# Altium project LED_Box.PrjPcb
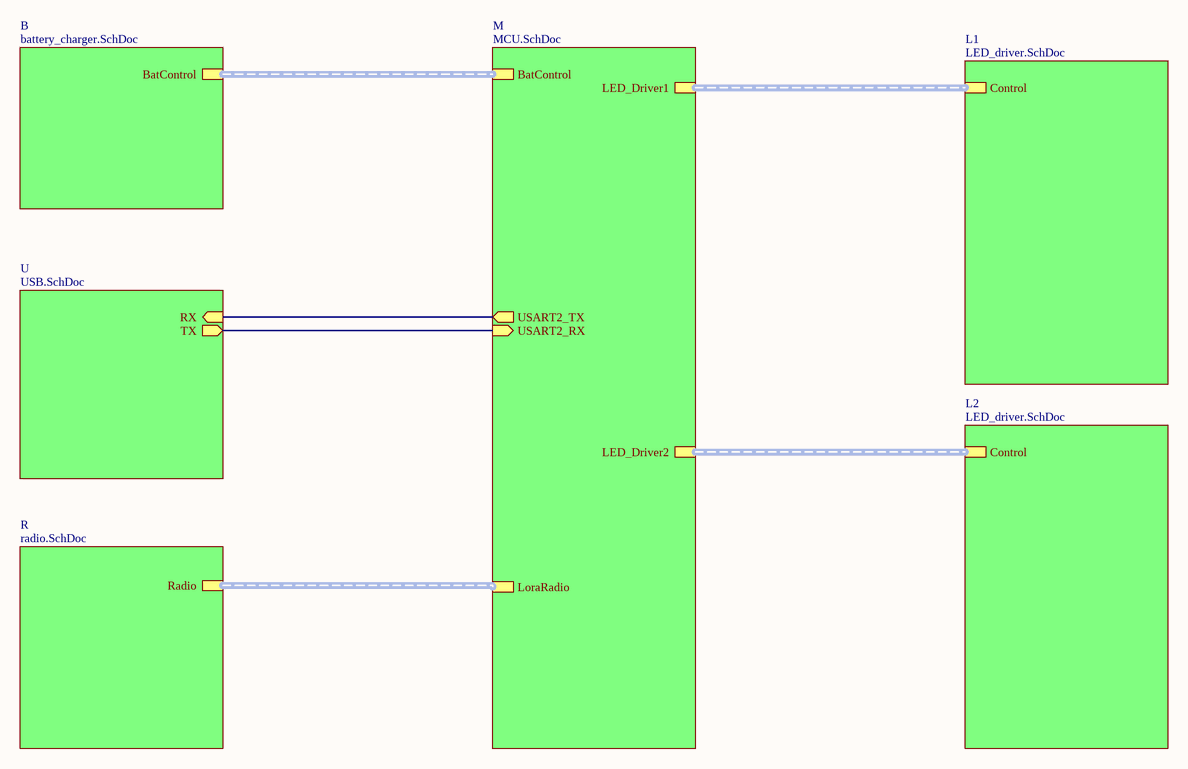
[diagram p0: main.SchDoc]
6 sheets, 189 parts. Net scope: hierarchical (ports join the sheet entries above them; power ports are global).
Board file: LED_Box.PcbDoc
Sheets:
  main.SchDoc
    B = battery_charger.SchDoc
    U = USB.SchDoc
    L1 = LED_driver.SchDoc
    L2 = LED_driver.SchDoc
    R = radio.SchDoc
    M = MCU.SchDoc

## Sheet main.SchDoc: Gesamtansicht
size A4; Author: Gerald Ebmer; DrawnBy: Gerald Ebmer; Engineer: Gerald Ebmer; Revision: 1.0; SheetNumber: 1; SheetTotal: 6; PageSetup: Record=PageOptions|CenterHorizontal=True|CenterVertical=True|PrintScale=1.00|XCorrection=1.00|YCorrection=1.00|PrintKind=0|BorderSize=5000000|LeftOffset=0|BottomOffset=0|Orientation=2|PaperLength=1000|PaperWidth=1000|Scale=100|PaperSource=7|PrintQuality=-3|MediaType=1|DitherType=10|PrintScaleMode=1|PaperKind=A4|PaperIndex=9

### Sub-sheets
B = battery_charger.SchDoc: BatControl (harness BatControl)
L1 = LED_driver.SchDoc: Control (harness LED_Driver)
L2 = LED_driver.SchDoc: Control (harness LED_Driver)
M = MCU.SchDoc: BatControl (harness BatControl), LED_Driver1 (harness LED_Driver), LED_Driver2 (harness LED_Driver), USART2_TX (out), USART2_RX (in), LoraRadio (harness Radio)
R = radio.SchDoc: Radio (harness Radio)
U = USB.SchDoc: RX (in), TX (out)

### Nets
USART2_RX: sheet U/TX, sheet M/USART2_RX
USART2_TX: sheet U/RX, sheet M/USART2_TX

### Buses and harness runs
harness sheet B/BatControl = sheet M/BatControl
harness sheet L1/Control = sheet M/LED_Driver1
harness sheet L2/Control = sheet M/LED_Driver2
harness sheet M/LoraRadio = sheet R/Radio

### Notes on the sheet
- Title
- Size:
- Date:
- A4
- Number:
- Time:
- Revision:
- Sheet
- of
- File:

## Sheet battery_charger.SchDoc: Battery & Power Management
size A4; Author: Gerald Ebmer; DrawnBy: Gerald Ebmer; Engineer: Gerald Ebmer; SheetNumber: 5; SheetTotal: 6; PageSetup: Record=PageOptions|CenterHorizontal=True|CenterVertical=True|PrintScale=1.00|XCorrection=1.00|YCorrection=1.00|PrintKind=0|BorderSize=5000000|LeftOffset=0|BottomOffset=0|Orientation=2|PaperLength=1000|PaperWidth=1000|Scale=100|PaperSource=7|PrintQuality=-3|MediaType=1|DitherType=10|PrintScaleMode=1|PaperKind=A4|PaperIndex=9
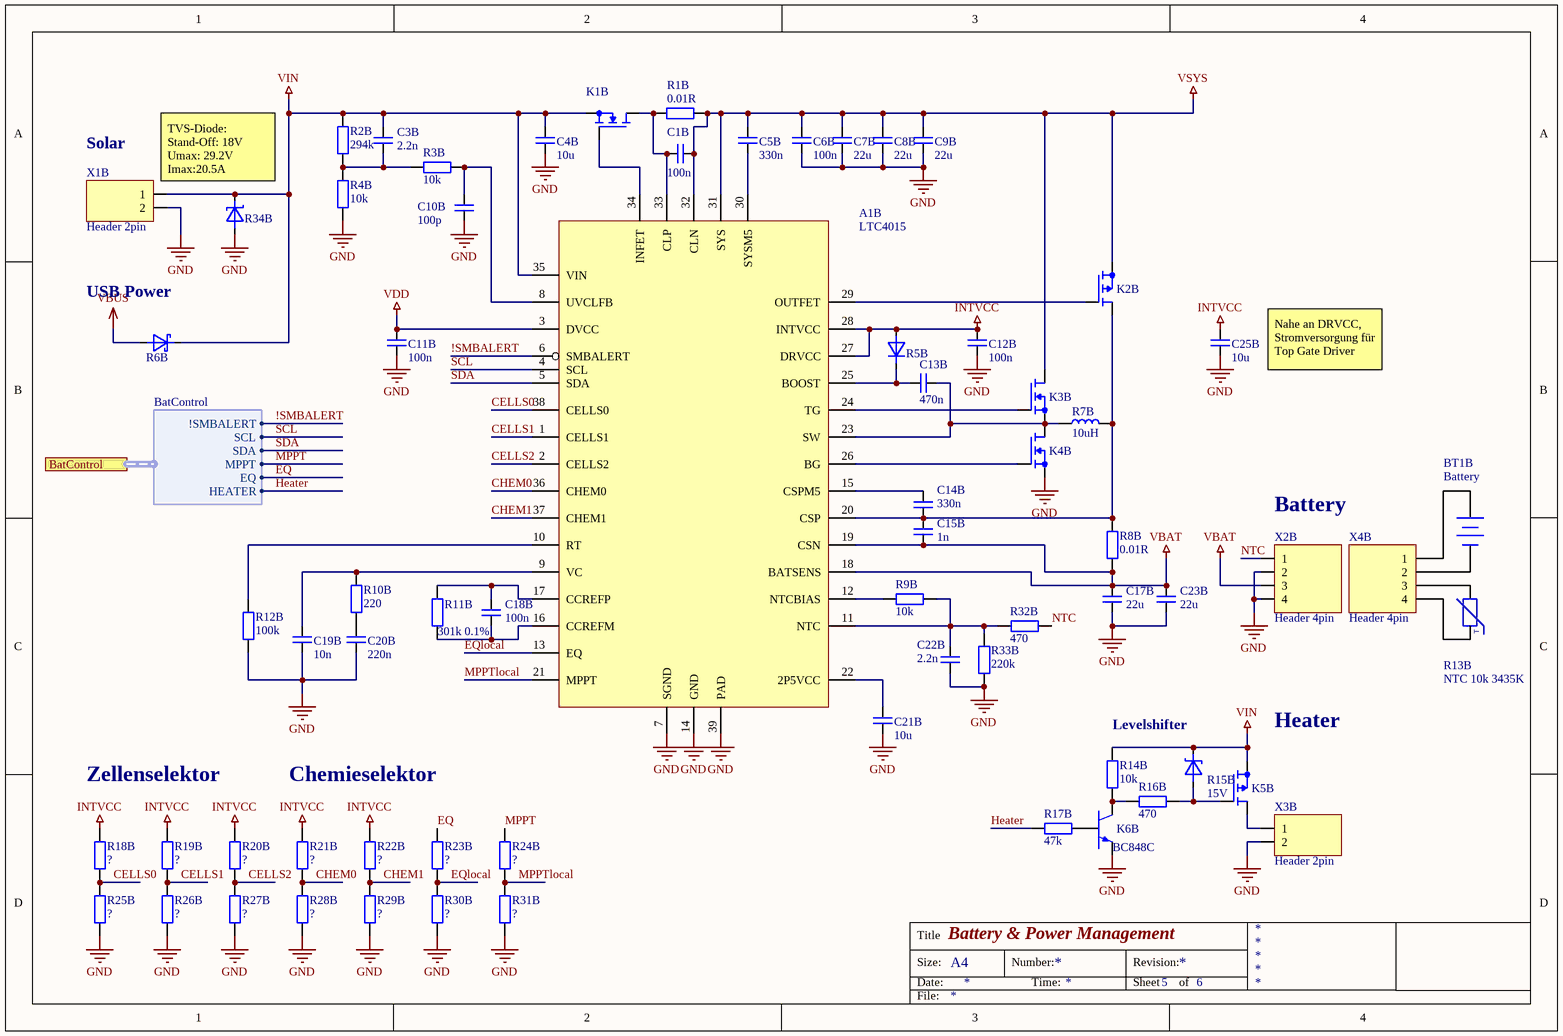
[diagram p1: battery_charger.SchDoc]

### Parts
A1B  LTC4015  [QFN38]
BT1B  Battery
C1B  100n  [0805]
C3B  2.2n  [0805]
C4B  10u  [1812]
C5B  330n  [0805]
C6B  100n  [0805]
C7B  22u  [1812]
C8B  22u  [1812]
C9B  22u  [1812]
C10B  100p  [0805]
C11B  100n  [0805]
C12B  100n  [0805]
C13B  470n  [0805]
C14B  330n  [0805]
C15B  1n  [0805]
C17B  22u  [1210]
C18B  100n  [0805]
C19B  10n  [0805]
C20B  220n  [0805]
C21B  10u  [0805]
C22B  2.2n  [0805]
C23B  22u  [1210]
C25B  10u  [0805]
K1B  FDMC8327L  [Power33]  (value not drawn)
K2B  SI7611DN  [Power33]  (value not drawn)
K3B  FDMC8327L  [Power33]  (value not drawn)
K4B  FDMC8327L  [Power33]  (value not drawn)
K5B  pmos FDC658  [SuperSOT-6]  (value not drawn)
K6B  BC848C  [SOT23-3]
R1B  0.01R  [2512]
R2B  294k  [0805]
R3B  10k  [0805]
R4B  10k  [0805]
R5B  1N4148W  [SOD123F]  (value not drawn)
R6B  Diode shottky  [PowerDI123]  (value not drawn)
R7B  10uH  [INDP_13.2_12.9X3.5M]
R8B  0.01R  [2512]
R9B  10k  [0805]
R10B  220  [0805]
R11B  301k 0.1%  [0805]
R12B  100k  [0805]
R13B  NTC 10k 3435K
R14B  10k  [0805]
R15B  15V  [SOD523]
R16B  470  [0805]
R17B  47k  [0805]
R18B  ?  [0805]
R19B  ?  [0805]
R20B  ?  [0805]
R21B  ?  [0805]
R22B  ?  [0805]
R23B  ?  [0805]
R24B  ?  [0805]
R25B  ?  [0805]
R26B  ?  [0805]
R27B  ?  [0805]
R28B  ?  [0805]
R29B  ?  [0805]
R30B  ?  [0805]
R31B  ?  [0805]
R32B  470  [0805]
R33B  220k  [0805]
R34B  TVS 29.2Vmax  [DO 214AA]  (value not drawn)
X1B  Header 2pin  [PHOENIX_1729128]
X2B  Header 4pin  [Phoenix, 5mm pitch, 4pin]
X3B  Header 2pin  [PHOENIX_1729128]
X4B  Header 4pin

### Ports
BatControl (harness BatControl)

### Harnesses
BatControl: !SMBALERT, SCL, SDA, MPPT, EQ, HEATER

### Nets
GND: A1B.7(SGND) A1B.14(GND) A1B.39(PAD) C4B.2 C6B.2 C7B.2 C8B.2 C9B.2 C10B.1 C11B.2 C12B.2 C17B.2 C19B.2 C20B.1 C21B.2 C22B.1 C23B.2 C25B.2 K4B.2(Source) K6B.2(Emitter) R4B.1 R12B.2 R25B.2 R26B.2 R27B.2 R28B.2 R29B.2 R30B.2 R31B.2 R33B.2 R34B.2(Annode) X1B.2 X2B.2 X2B.4 X3B.2
INTVCC: A1B.27(DRVCC) A1B.28(INTVCC) C12B.1 C25B.1 R5B.2(Annode) R18B.1 R19B.1 R20B.1 R21B.1 R22B.1
VBAT: A1B.18(BATSENS) A1B.19(CSN) C15B.1 C17B.1 C23B.1 R8B.2 X2B.3
VBUS: R6B.2(Annode)
VDD: A1B.3(DVCC) C11B.1
VIN: A1B.35(VIN) C3B.2 C4B.1 K1B.2(Source) K5B.2(Source) R2B.2 R6B.1(Kathode) R14B.2 R15B.1(Kathode) R34B.1(Kathode) X1B.1
VSYS: A1B.31(SYS) A1B.32(CLN) C1B.1 C5B.1 C6B.1 C7B.1 C8B.1 C9B.1 K2B.2(Source) K3B.1(Drain) R1B.1
!SMBALERT: A1B.6(SMBALERT) ; port BatControl.!SMBALERT
CELLS0: A1B.38(CELLS0) R18B.2 R25B.1
CELLS1: A1B.1(CELLS1) R19B.2 R26B.1
CELLS2: A1B.2(CELLS2) R20B.2 R27B.1
CHEM0: A1B.36(CHEM0) R21B.2 R28B.1
CHEM1: A1B.37(CHEM1) R22B.2 R29B.1
EQ: R23B.1 ; port BatControl.EQ
EQlocal: A1B.13(EQ) R23B.2 R30B.1
Heater: R17B.1 ; port BatControl.HEATER
MPPT: R24B.1 ; port BatControl.MPPT
MPPTlocal: A1B.21(MPPT) R24B.2 R31B.1
NTC: R32B.2 X2B.1
SCL: A1B.4(SCL) ; port BatControl.SCL  [project net I2C1_SCL]
SDA: A1B.5(SDA) ; port BatControl.SDA  [project net I2C1_SDA]
NetA1B_8: A1B.8(UVCLFB) C10B.2 R3B.1
NetA1B_9: A1B.9(VC) C19B.1 R10B.1
NetA1B_10: A1B.10(RT) R12B.1
NetA1B_11: A1B.11(NTC) C22B.2 R9B.1 R32B.1 R33B.1
NetA1B_12: A1B.12(NTCBIAS) R9B.2
NetA1B_15: A1B.15(CSPM5) C14B.1
NetA1B_16: A1B.16(CCREFM) C18B.1 R11B.2
NetA1B_17: A1B.17(CCREFP) C18B.2 R11B.1
NetA1B_20: A1B.20(CSP) C14B.2 C15B.2 K2B.1(Drain) R7B.2 R8B.1
NetA1B_22: A1B.22(2P5VCC) C21B.1
NetA1B_23: A1B.23(SW) C13B.1 K3B.2(Source) K4B.1(Drain) R7B.1
NetA1B_24: A1B.24(TG) K3B.3(Gate)
NetA1B_25: A1B.25(BOOST) C13B.2 R5B.1(Kathode)
NetA1B_26: A1B.26(BG) K4B.3(Gate)
NetA1B_29: A1B.29(OUTFET) K2B.3(Gate)
NetA1B_30: A1B.30(SYSM5) C5B.2
NetA1B_33: A1B.33(CLP) C1B.2 K1B.1(Drain) R1B.2
NetA1B_34: A1B.34(INFET) K1B.3(Gate)
NetC3B_1: C3B.1 R2B.1 R3B.2 R4B.2
NetC20B_2: C20B.2 R10B.2
NetK5B_1: K5B.1(Drain) X3B.1
NetK5B_3: K5B.3(Gate) R15B.2(Annode) R16B.2
NetK6B_1: K6B.1(Collector) R14B.1 R16B.1
NetK6B_3: K6B.3(Basis) R17B.2

Not connected (* = marked no-connect by the designer): BT1B 1(+) 2(-); R13B 1 2; X4B 1 2 3 4

### Notes on the sheet
- (near X1B) Solar
- TVS-Diode:
  Stand-Off: 18V
  Umax: 29.2V
  Imax:20.5A
- (near R6B) USB Power
- (near C25B) Nahe an DRVCC, Stromversorgung für Top Gate Driver
- (near X2B) Battery
- Zellenselektor
- Chemieselektor
- Levelshifter
- (near K5B) Heater
- Title
- Size:
- Date:
- A4
- Number:
- Time:
- Revision:
- Sheet
- of
- File:
- (in symbol PTC) T

### Library data of the parts
A1B = LTC4015: Multichemistry Buck Battery Charger Controller with Digital Telemetry System; Bauform: *; Bestell-Nr.: *; Bezeichnung: *; Hersteller: *; Lieferant: *; Preis: *
BT1B = Battery: Multicell Battery; Published: 24-Mar-1999; LatestRevisionDate: 17-Jul-2002; LatestRevisionNote: Re-released for DXP Platform.; PackageReference: BAT-2; Publisher: Altium Limited; PackageDescription: Battery; 2 Leads
C1B C6B C11B C12B C18B = Kondensator: Bezeichnung: 08055C104KAT2A; Hersteller: AVX; Lieferant: RS Components; Bestell-Nr.: 464-6688; Bauform: 0805
C3B C22B = Kondensator: Bezeichnung: MC0805B222K500CT; Hersteller: MULTICOMP; Lieferant: Farnell; Bestell-Nr.: 1759235; Bauform: *; Preis: *
C4B C21B C25B = Kondensator: Bezeichnung: C1210C106K3RACTU; Hersteller: Kemet; Lieferant: Farnell; Bestell-Nr.: 1358512; Bauform: *; Preis: *
C5B C14B = Kondensator: Bezeichnung: 08053C334KAT2A; Hersteller: AVX; Lieferant: Farnell; Bestell-Nr.: 1833878; Bauform: *; Preis: *
C7B C8B C9B = Kondensator: Bezeichnung: CGA8P1X7R1E226M250KC; Hersteller: TDK; Lieferant: RS Components; Bestell-Nr.: 915-5465; Bauform: *; Preis: *
C10B = Kondensator: Bezeichnung: MC0805N101J500CT; Hersteller: MULTICOMP; Lieferant: Farnell; Bestell-Nr.: 1759203; Bauform: *; Preis: *
C13B = Kondensator: Bezeichnung: MC0805B474K500CT; Hersteller: MULTICOMP; Lieferant: Farnell; Bestell-Nr.: 2320847; Bauform: *; Preis: *
C15B = Kondensator: Bezeichnung: MCU0805C102JCT; Hersteller: MULTICOMP; Lieferant: Farnell; Bestell-Nr.: 9406212; Bauform: *; Preis: *
C17B C23B = Kondensator: Bezeichnung: C3225X7R1C226K250AC; Hersteller: TDK; Lieferant: Farnell; Bestell-Nr.: 2112725; Bauform: *; Preis: *
C19B = Kondensator: Bezeichnung: C0805C103M5RACTU; Hersteller: Kemet; Lieferant: Farnell; Bestell-Nr.: 2581081; Bauform: 0805
C20B = Kondensator: Bezeichnung: C0805C224K5RACTU; Hersteller: Kemet; Lieferant: Farnell; Bestell-Nr.: 1288261; Bauform: *; Preis: *
K1B K3B K4B = MOSFET N-channel enh: Lieferant: RS Components; Hersteller: Fairchild Semiconductor; Bestell-Nr.: 864-8203; Bezeichnung: FDMC8327L; Preis: *; Bauform: *
K2B = MOSFET P-channel enh: Bezeichnung: SI7611DN-T1-GE3; Lieferant: Farnell; Hersteller: Vishay; Bestell-Nr.: 2547310; Preis: *; Bauform: *
K5B = MOSFET P-channel enh: Bezeichnung: FDC658P; Lieferant: RS Components; Hersteller: Fairchild; Bestell-Nr.: 671-0359; Bauform: SuperSOT-6
K6B = Transistor NPN: Lieferant: RS Components; Hersteller: Infineon; Bestell-Nr.: 445-2039; Bezeichnung: BC848C; Preis: *; Bauform: *
R1B R8B = Widerstand: Bezeichnung: ERJM1WSF10MU; Lieferant: RS Components; Bestell-Nr.: 567-045; Hersteller: Panasonic; Bauform: *; Preis: *
R2B = Widerstand: Bezeichnung: ERJ6ENF2943V; Lieferant: Farnell; Bestell-Nr.: 2303812; Hersteller: PANASONIC ELECTRONIC COMPONENTS; Bauform: 0805; Preis: *
R3B R4B R9B R14B = Widerstand: Bezeichnung: MCWR08X1002FTL; Lieferant: Farnell; Bestell-Nr.: 2447553; Hersteller: MULTICOMP; Bauform: 0805; Preis: *
R5B = Diode: Bezeichnung: 1N4148W-7-F.; Lieferant: Farnell; Hersteller: Diodes Inc; Bestell-Nr.: 1776392; Preis: *; Bauform: *
R6B = Diode shottky: Bezeichnung: DFLS240L-7; Lieferant: RS Components; Hersteller: DiodesZetex; Bestell-Nr.: 708-2337; Preis: *; Bauform: *
R7B = Induktivität: Bezeichnung: IHLP5050CEER100M01; Lieferant: RS Components; Bestell-Nr.: 748-7331; Hersteller: Vishay; Bauform: *; Preis: *
R10B = Widerstand: Bezeichnung: MCWR08X2200FTL; Lieferant: Farnell; Bestell-Nr.: 2447606; Hersteller: MULTICOMP; Bauform: 0805; Preis: *
R11B = Widerstand: Bezeichnung: RP73PF2A301KBTDF; Lieferant: Farnell; Bestell-Nr.: 2117426; Hersteller: TE CONNECTIVITY; Bauform: *; Preis: *
R12B = Widerstand: Bezeichnung: MCWR08X1003FTL; Lieferant: Farnell; Bestell-Nr.: 2447551; Hersteller: MULTICOMP; Bauform: 0805; Preis: *
R13B = PTC: Lieferant: Farnell; Bestell-Nr.: 2492885; Hersteller: Vishay; Bezeichnung: NTCLE413E2103F102L; Preis: *; Bauform: *
R15B = Diode zener: Bezeichnung: MM5Z15V; Lieferant: RS Components; Hersteller: Fairchild Semiconductor; Bestell-Nr.: 802-3004; Preis: *; Bauform: *
R16B R32B = Widerstand: Bezeichnung: MCWR08X4700FTL; Lieferant: Farnell; Bestell-Nr.: 2447662; Hersteller: MULTICOMP; Bauform: 0805; Preis: *
R17B = Widerstand: Bezeichnung: MCWR08X4702FTL; Lieferant: Farnell; Bestell-Nr.: 2447664; Hersteller: MULTICOMP; Bauform: 0805; Preis: *
R18B R19B R20B R21B R22B R23B R24B R25B R26B R27B R28B R29B R30B R31B = Widerstand: Bezeichnung: *; Lieferant: *; Bestell-Nr.: *; Bauform: *; Hersteller: *; Preis: *
R33B = Widerstand: Bezeichnung: MCWR08X224 JTL; Lieferant: Farnell; Bestell-Nr.: 2695016; Hersteller: MULTICOMP; Bauform: 0805; Preis: *
R34B = Diode TVS unipolar: unipolar transient voltage suppression diode; Bezeichnung: SMBJ18A-E3/52; Lieferant: RS Components; Hersteller: Vishay; Bestell-Nr.: 636-5303; Preis: *; Bauform: *
X1B X3B = Header 2pin: Hersteller: Phoenix Contact; Lieferant: RS Components; Bezeichnung: 1729128; Bestell-Nr.: 193-0586; Bauform: *; Preis: *
X2B = Header 4pin: Hersteller: PHOENIX CONTACT; Bestell-Nr.: 2671251; Lieferant: Farnell; Bezeichnung: MSTBA 2,5/ 4-G; Preis: *; Bauform: *
X4B = Header 4pin: Hersteller: Phoenix Contact; Bestell-Nr.: 2776549; Lieferant: Farnell; Bezeichnung: 1779851; Preis: *; Bauform: *

## Sheet USB.SchDoc: USB - UART Schnittstelle
size A4; Author: Gerald Ebmer; DrawnBy: Gerald Ebmer; Engineer: Gerald Ebmer; Revision: 1.1; SheetNumber: 2; SheetTotal: 6; PageSetup: Record=PageOptions|CenterHorizontal=True|CenterVertical=True|PrintScale=1.00|XCorrection=1.00|YCorrection=1.00|PrintKind=0|BorderSize=5000000|LeftOffset=0|BottomOffset=0|Orientation=2|PaperLength=1000|PaperWidth=1000|Scale=100|PaperSource=7|PrintQuality=-3|MediaType=1|DitherType=10|PrintScaleMode=1|PaperKind=A4|PaperIndex=9
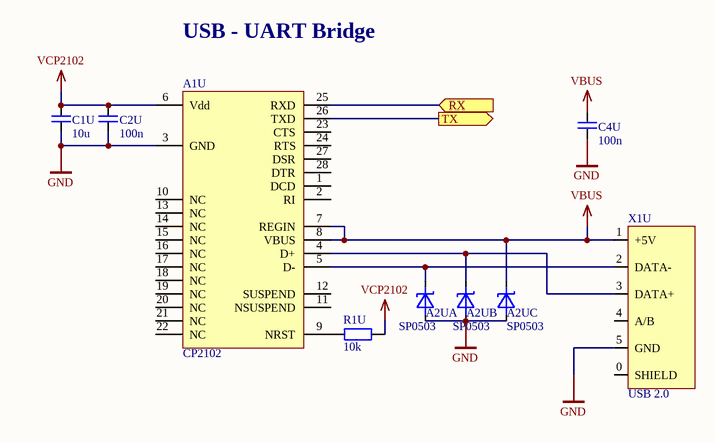
[diagram p2: USB.SchDoc]

### Parts
A1U  CP2102  [QFN28]
A2U  SP0503  [SOT143-4]  (parts A,B,C of 3)
C1U  10u  [0805]
C2U  100n  [0805]
C4U  100n  [0805]
R1U  10k  [0805]
X1U  USB 2.0  [USB Mini AB]

### Ports
RX (in), TX (out)

### Nets
GND: A1U.3(GND) A2U.1(Annode) C1U.1 C2U.1 C4U.1 X1U.5(GND)
VBUS: A1U.7(REGIN) A1U.8(VBUS) A2U.4(K3) C4U.2 X1U.1(+5V)
VCP2102: A1U.6(Vdd) C1U.2 C2U.2 R1U.2
USART2_RX: A1U.26(TXD) ; port TX
USART2_TX: A1U.25(RXD) ; port RX
NetA1U_4: A1U.4(D+) A2U.3(K3) X1U.3(DATA+)
NetA1U_5: A1U.5(D-) A2U.2(K1) X1U.2(DATA-)
NetA1U_9: A1U.9(NRST) R1U.1

Not connected (* = marked no-connect by the designer): A1U 1(DCD) 2(RI) 10(NC) 11(NSUSPEND) 12(SUSPEND) 13(NC) 14(NC) 15(NC) 16(NC) 17(NC) 18(NC) 19(NC) 20(NC) 21(NC) 22(NC) 23(CTS) 24(RTS) 27(DSR) 28(DTR); X1U 0(SHIELD) 4(A/B)

### Notes on the sheet
- USB - UART Bridge
- Title
- Size:
- Date:
- A4
- Number:
- Time:
- Revision:
- Sheet
- of
- File:

### Library data of the parts
A1U = CP2102: USB-UART Bridge; Bauform: QFN-28; Bestell-Nr.: 526-8841; Bezeichnung: CP2102-GM; Hersteller: Silicon Labs; Lieferant: RS Components
A2U = SP0503: ESD Suppressors; Bauform: SMD; Bestell-Nr.: 793-1967; Bezeichnung: SP0503BAHTG; Hersteller: Littelfuse; Lieferant: RS Components
C1U = Kondensator: as C4B on sheet battery_charger; Bauform: 0805
C2U C4U = Kondensator: as C1B on sheet battery_charger; Bauform: 0805
R1U = Widerstand: as R3B on sheet battery_charger; Bauform: 0805
X1U = USB 2.0: Hersteller: TE Connectivity; Lieferant: Farnell; Bezeichnung: 1734328-1; Bestell-Nr.: 2112375; Bauform: USB-Mini AB

## Sheet LED_driver.SchDoc: LED Driver
size A4; Author: Gerald Ebmer; DrawnBy: Gerald Ebmer; Engineer: Gerald Ebmer; Revision: 1.1; SheetNumber: 1; SheetTotal: 6; PageSetup: Record=PageOptions|CenterHorizontal=True|CenterVertical=True|PrintScale=1.00|XCorrection=1.00|YCorrection=1.00|PrintKind=0|BorderSize=5000000|LeftOffset=0|BottomOffset=0|Orientation=2|PaperLength=1000|PaperWidth=1000|Scale=100|PaperSource=7|PrintQuality=-3|MediaType=1|DitherType=10|PrintScaleMode=1|PaperKind=A4|PaperIndex=9; Time: 3
Used 2 times, as channels L1, L2. Parts and nets are listed once, with the designators drawn on the sheet.
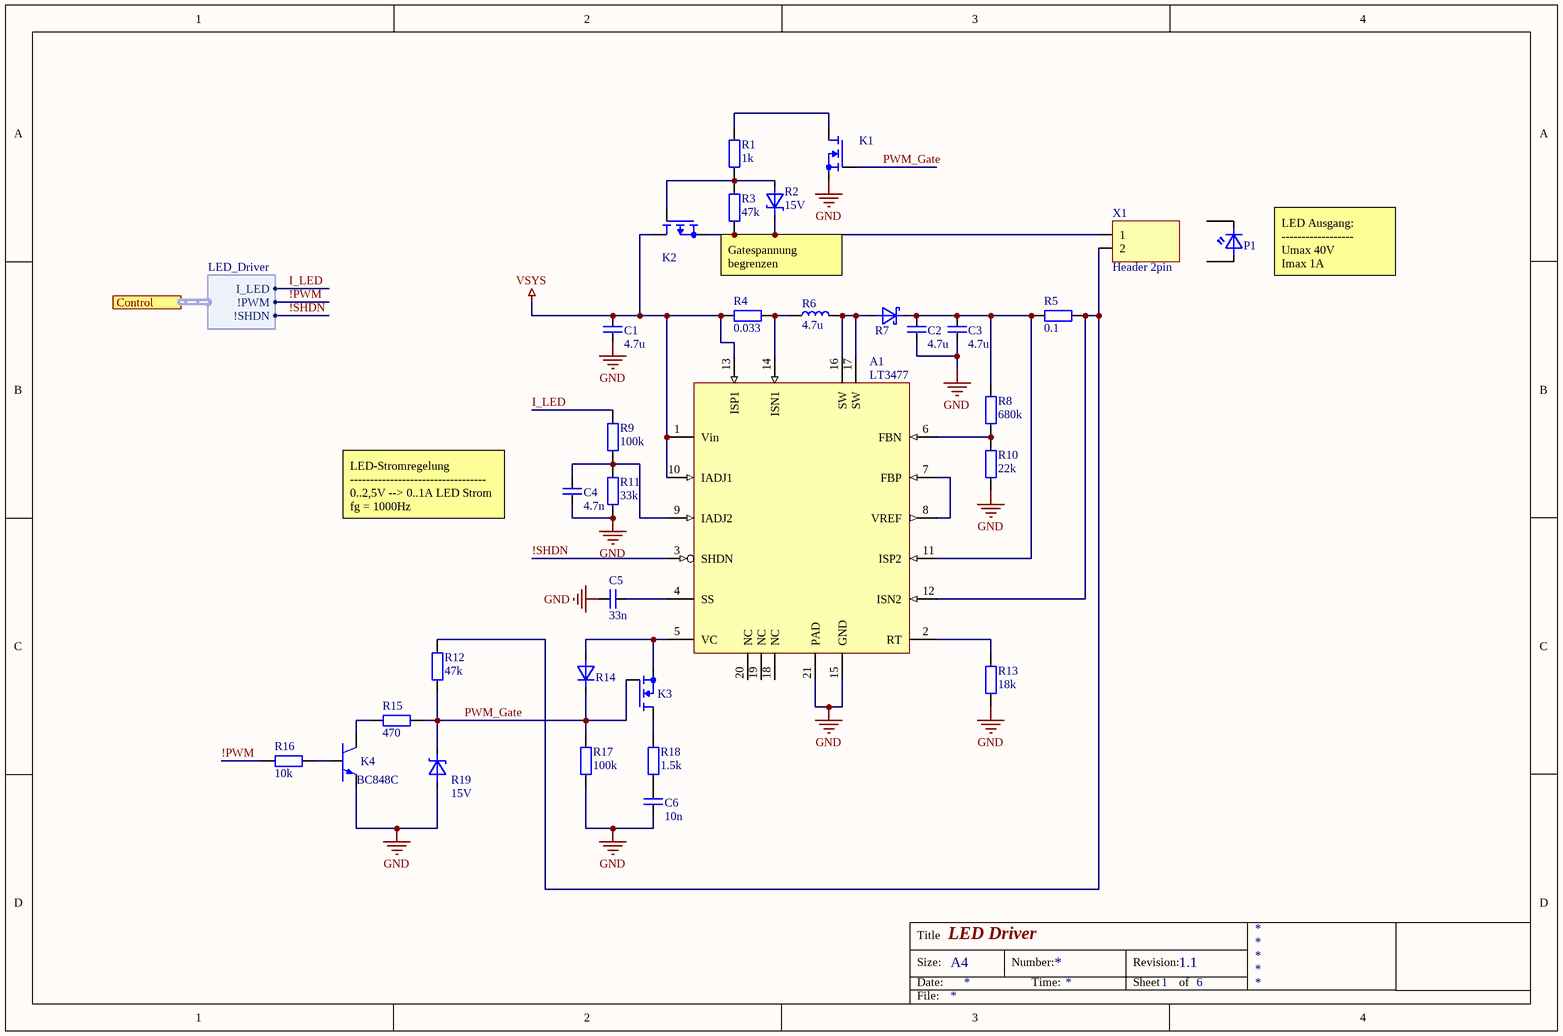
[diagram p3: LED_driver.SchDoc]

### Parts
A1  LT3477  [TSSOP20 exposed pad]
C1  4.7u  [1210]
C2  4.7u  [1210]
C3  4.7u  [1210]
C4  4.7n  [0805]
C5  33n  [0805]
C6  10n  [0805]
K1  MOSFET N-channel enh  [SOT23-3]  (value not drawn)
K2  pmos FDC658  [SuperSOT-6]  (value not drawn)
K3  MOSFET N-channel enh  [SOT23-3]  (value not drawn)
K4  BC848C  [SOT23-3]
P1  LED  (value not drawn)
R1  1k  [0805]
R2  15V  [SOD523]
R3  47k  [0805]
R4  0.033  [2512]
R5  0.1  [2512]
R6  4.7u  [SMD_Ind_5x5]
R7  Diode shottky  [PowerDI123]  (value not drawn)
R8  680k  [0805]
R9  100k  [0805]
R10  22k  [0805]
R11  33k  [0805]
R12  47k  [0805]
R13  18k  [0805]
R14  1N4148W  [SOD123F]  (value not drawn)
R15  470  [0805]
R16  10k  [0805]
R17  100k  [0805]
R18  1.5k  [0805]
R19  15V  [SOD523]
X1  Header 2pin  [PHOENIX_1729128]

### Ports
Control (harness LED_Driver)

### Harnesses
LED_Driver: I_LED, !PWM, !SHDN

### Nets
GND: A1.15(GND) A1.21(PAD) C1.1 C2.1 C3.1 C4.2 C5.2 C6.1 K1.2(Source) K4.2(Emitter) R10.1 R11.1 R13.1 R17.1 R19.2(Annode)
VSYS: A1.1(Vin) A1.10(IADJ1) A1.13(ISP1) C1.2 K2.1(Drain) R4.1
!PWM: R16.1 ; port Control.!PWM
!SHDN: A1.3(SHDN) ; port Control.!SHDN
I_LED: R9.2 ; port Control.I_LED
PWM_Gate: K1.3(Gate) K3.3(Gate) R12.2 R14.1(Kathode) R15.2 R17.2 R19.1(Kathode)
NetA1_2: A1.2(RT) R13.2
NetA1_4: A1.4(SS) C5.1
NetA1_5: A1.5(VC) K3.2(Source) R14.2(Annode)
NetA1_6: A1.6(FBN) R8.1 R10.2
NetA1_7: A1.7(FBP) A1.8(VREF)
NetA1_9: A1.9(IADJ2) C4.1 R9.1 R11.2
NetA1_11: A1.11(ISP2) C2.2 C3.2 R5.1 R7.1(Kathode) R8.2
NetA1_12: A1.12(ISN2) R5.2 R12.1 X1.2
NetA1_14: A1.14(ISN1) R4.2 R6.1
NetA1_16: A1.16(SW) A1.17(SW) R6.2 R7.2(Annode)
NetC6_2: C6.2 R18.1
NetK1_1: K1.1(Drain) R1.2
NetK2_2: K2.2(Source) R2.1(Kathode) R3.1 X1.1
NetK2_3: K2.3(Gate) R1.1 R2.2(Annode) R3.2
NetK3_1: K3.1(Drain) R18.2
NetK4_1: K4.1(Collector) R15.1
NetK4_3: K4.3(Basis) R16.2

Not connected (* = marked no-connect by the designer): A1 18(NC) 19(NC) 20(NC); P1 1(Kathode) 2(Annode)

### Channels
L1: designators end in L1
L2: designators end in L2

### Notes on the sheet
- Gatespannung begrenzen
- (near P1) LED Ausgang:
  ------------------
  Umax 40V
  Imax 1A
- LED-Stromregelung
  ----------------------------------
  0..2,5V --> 0..1A LED Strom
  fg = 1000Hz
- Title
- Size:
- Date:
- A4
- Number:
- Time:
- Revision:
- Sheet
- of
- File:

### Library data of the parts
A1 = LT3477: 3A, DC/DC Converter with Dual Rail-to-Rail Current Sense; Bauform: *; Bestell-Nr.: *; Bezeichnung: *; Hersteller: *; Lieferant: *; Preis: *
C1-C3 = Kondensator: Bezeichnung: C1210C475K5RACTU; Hersteller: KEMET; Lieferant: RS Components; Bestell-Nr.: 691-1265; Bauform: *; Preis: *
C4 C5 = Kondensator: Bezeichnung: C2012C0G1E333J125AA; Hersteller: TDK; Lieferant: RS Components; Bestell-Nr.: 915-9249; Bauform: *; Preis: *
C6 = Kondensator: as C19B on sheet battery_charger; Bauform: 0805
K1 K3 = MOSFET N-channel enh: Bezeichnung: 2N7002; Lieferant: RS Components; Hersteller: Fairchild Semiconductor; Bestell-Nr.: 671-0312; Preis: *; Bauform: *
K2 = MOSFET P-channel enh: as K5B on sheet battery_charger; Bauform: SuperSOT-6
K4 = Transistor NPN: as K6B on sheet battery_charger; Bezeichnung: BC848C; Preis: *; Bauform: *
R1 = Widerstand: Bezeichnung: MCWR08X1001FTL; Lieferant: Farnell; Bestell-Nr.: 2447587; Hersteller: MULTICOMP; Bauform: 0805; Preis: *
R2 R19 = Diode zener: as R15B on sheet battery_charger; Preis: *; Bauform: *
R3 R12 = Widerstand: as R17B on sheet battery_charger; Bauform: 0805
R4 = Widerstand: Bezeichnung: TLM3ADR033FTE; Lieferant: RS Components; Bestell-Nr.: 869-5505; Hersteller: TE Connectivity; Bauform: *; Preis: *
R5 = Widerstand: Bezeichnung: RL73K3AR10J; Lieferant: RS Components; Bestell-Nr.: 223-0972; Hersteller: TE Connectivity; Bauform: *; Preis: *
R6 = Induktivität: Bezeichnung: 744316470; Lieferant: RS Components; Bestell-Nr.: 863-1075; Hersteller: Würth; Bauform: *
R7 = Diode shottky: as R6B on sheet battery_charger; Preis: *; Bauform: *
R8 = Widerstand: Bezeichnung: MCWR08X6803FTL; Lieferant: Farnell; Bestell-Nr.: 2447704; Hersteller: C; Bauform: 0805; Preis: *
R9 R17 = Widerstand: as R12B on sheet battery_charger; Bauform: 0805; Preis: *
R10 = Widerstand: Bezeichnung: MCWR08X2202FTL; Lieferant: Farnell; Bestell-Nr.: 2447607; Hersteller: MULTICOMP; Bauform: 0805; Preis: *
R11 = Widerstand: Bezeichnung: MCWR08X3302FTL; Lieferant: Farnell; Bestell-Nr.: 2447639; Hersteller: MULTICOMP; Bauform: 0805; Preis: *
R13 = Widerstand: Bezeichnung: MCWR08X1802FTL; Lieferant: Farnell; Bestell-Nr.: 2447584; Hersteller: MULTICOMP; Bauform: 0805; Preis: *
R14 = Diode: as R5B on sheet battery_charger; Preis: *; Bauform: *
R15 = Widerstand: as R16B on sheet battery_charger; Bauform: 0805; Preis: *
R16 = Widerstand: as R3B on sheet battery_charger; Bauform: 0805; Preis: *
R18 = Widerstand: Bezeichnung: MCWR08X1501FTL; Lieferant: Farnell; Bestell-Nr.: 2447592; Hersteller: MULTICOMP; Bauform: 0805; Preis: *
X1 = Header 2pin: as X1B on sheet battery_charger; Bauform: *; Preis: *
P1 = LED: Bezeichnung: *; Preis: *; Bauform: *; Lieferant: *; Hersteller: *; Bestell-Nr.: *

## Sheet radio.SchDoc: LoRa Radio Module
size A4; Author: Gerald Ebmer; DrawnBy: Gerald Ebmer; Engineer: Gerald Ebmer; Revision: 1.1; SheetNumber: 4; SheetTotal: 6; PageSetup: Record=PageOptions|CenterHorizontal=True|CenterVertical=True|PrintScale=1.00|XCorrection=1.00|YCorrection=1.00|PrintKind=0|BorderSize=5000000|LeftOffset=0|BottomOffset=0|Orientation=2|PaperLength=1000|PaperWidth=1000|Scale=100|PaperSource=7|PrintQuality=-3|MediaType=1|DitherType=10|PrintScaleMode=1|PaperKind=A4|PaperIndex=9
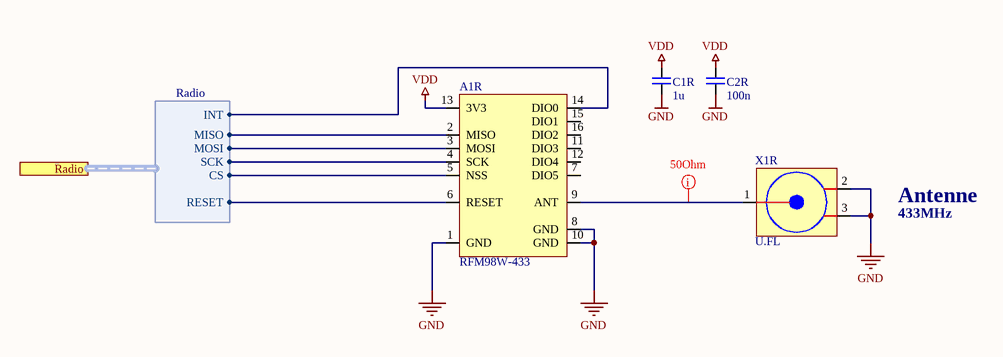
[diagram p4: radio.SchDoc]

### Parts
A1R  RFM98W-433  [RFM98W]
C1R  1u  [0805]
C2R  100n  [0805]
X1R  U.FL  [UFL]

### Ports
Radio (harness Radio)

### Harnesses
Radio: CS, INT, MISO, MOSI, RESET, SCK

### Nets
GND: A1R.1(GND) A1R.8(GND) A1R.10(GND) C1R.1 C2R.1 X1R.2(GND) X1R.3(GND)
VDD: A1R.13(3V3) C1R.2 C2R.2
RADIO_CS: A1R.5(NSS) ; port Radio.CS
RADIO_INT: A1R.14(DIO0) ; port Radio.INT
RADIO_RESET: A1R.6(RESET) ; port Radio.RESET
SPI2_MISO: A1R.2(MISO) ; port Radio.MISO
SPI2_MOSI: A1R.3(MOSI) ; port Radio.MOSI
SPI2_SCK: A1R.4(SCK) ; port Radio.SCK
NetA1R_9: A1R.9(ANT) X1R.1(Signal)

Not connected (* = marked no-connect by the designer): A1R 7(DIO5) 11(DIO3) 12(DIO4) 15(DIO1) 16(DIO2)

### Layout directives
net class Undefined: NetA1R_9

### Notes on the sheet
- 433MHz
- Antenne
- Title
- Size:
- Date:
- A4
- Number:
- Time:
- Revision:
- Sheet
- of
- File:

### Library data of the parts
A1R = RFM98W: LoRa Module / 433 MHz; Bestell-Nr.: RFM98W-433S2; Hersteller: HOPE MICROELECTRONICS; Lieferant: TME; Bauform: *; Bezeichnung: RFM98W-433S2; Preis: *
C1R = Kondensator: Bezeichnung: C0805C105K3RACTU; Hersteller: KEMET; Lieferant: Farnell; Bestell-Nr.: 1637035; Bauform: 0805
C2R = Kondensator: as C1B on sheet battery_charger; Bauform: 0805
X1R = U.FL: Hersteller: HIROSE(HRS); Lieferant: Farnell; Bauform: SMD; Bezeichnung: U.FL-R-SMT-1(10); Bestell-Nr.: 1688077; Preis: *

## Sheet MCU.SchDoc: MCU
size A4; Author: Gerald Ebmer; DrawnBy: Gerald Ebmer; Engineer: Gerald Ebmer; Revision: 1.1; SheetNumber: 6; SheetTotal: 6; PageSetup: Record=PageOptions|CenterHorizontal=True|CenterVertical=True|PrintScale=1.00|XCorrection=1.00|YCorrection=1.00|PrintKind=0|BorderSize=5000000|LeftOffset=0|BottomOffset=0|Orientation=2|PaperLength=1000|PaperWidth=1000|Scale=100|PaperSource=7|PrintQuality=-3|MediaType=1|DitherType=10|PrintScaleMode=1|PaperKind=A4|PaperIndex=9
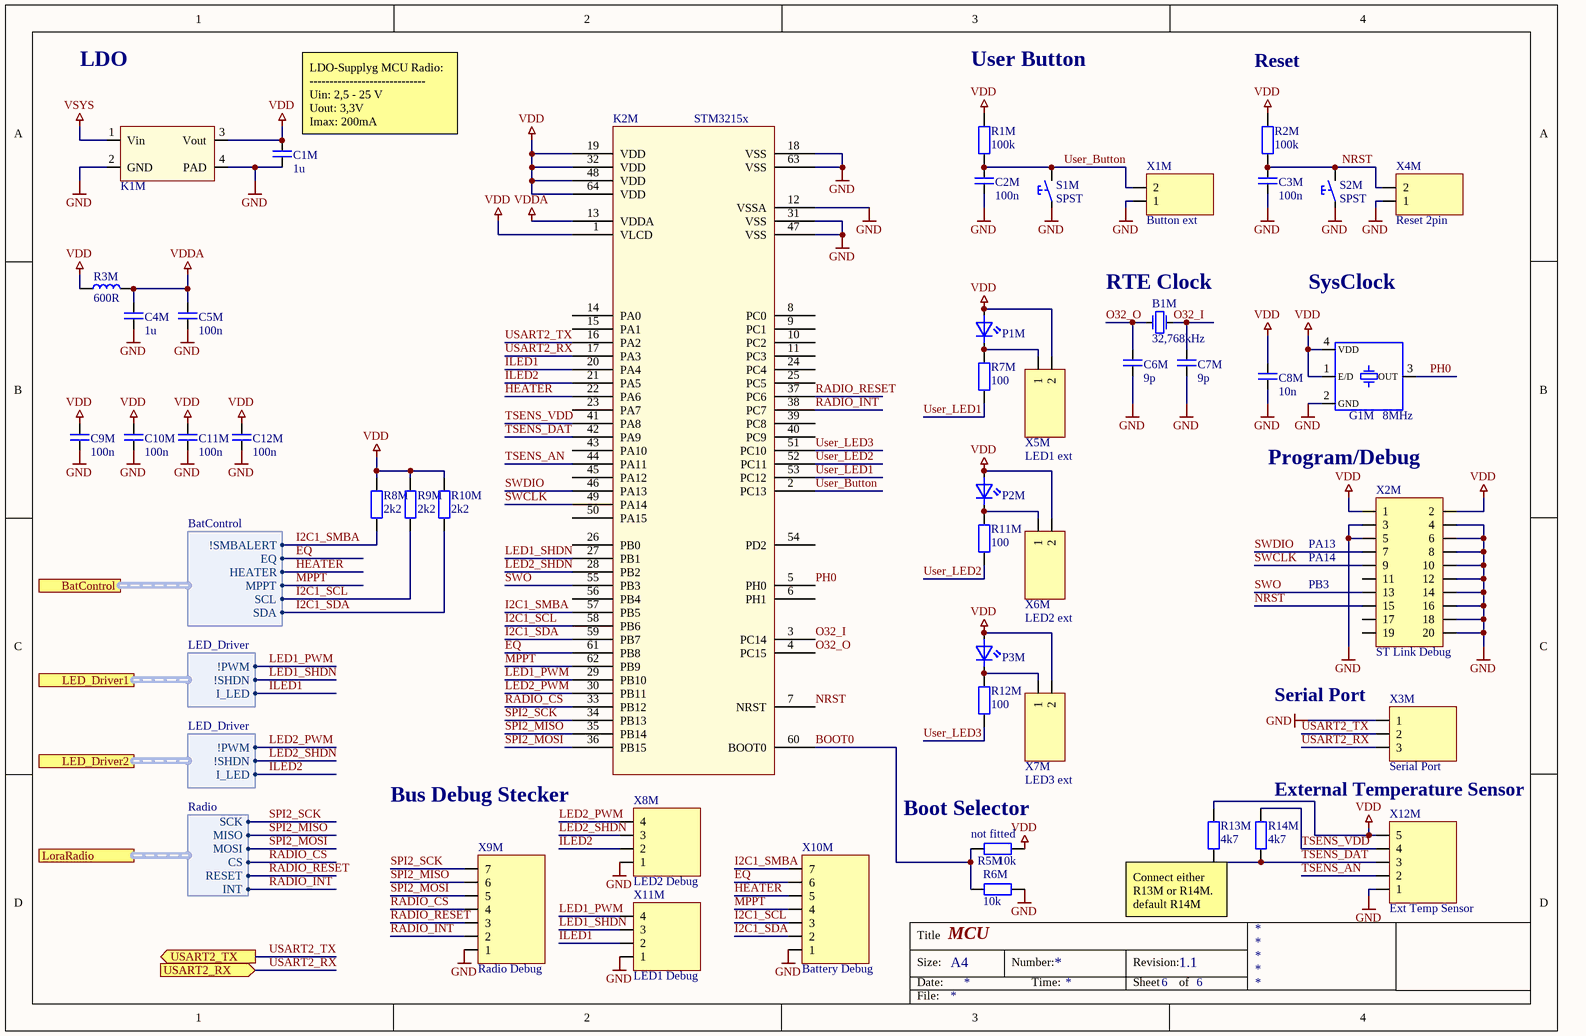
[diagram p5: MCU.SchDoc]

### Parts
B1M  32,768kHz  [0805]
C1M  1u  [0805]
C2M  100n  [0805]
C3M  100n  [0805]
C4M  1u  [0805]
C5M  100n  [0805]
C6M  9p  [0805]
C7M  9p  [0805]
C8M  10n  [0805]
C9M  100n  [0805]
C10M  100n  [0805]
C11M  100n  [0805]
C12M  100n  [0805]
G1M  8MHz  [SMT 3.2x2.5]
K1M  LDO_2  [SOT223-4L]  (value not drawn)
K2M  STM3215x  [LQFP64, 0.5mm pitch]
P1M  LED grün  [1206 D]  (value not drawn)
P2M  LED gelb  [1206 D]  (value not drawn)
P3M  LED rot  [1206 D]  (value not drawn)
R1M  100k  [0805]
R2M  100k  [0805]
R3M  600R  [0805]
R5M  10k  [0805]
R6M  10k  [0805]
R7M  100  [0805]
R8M  2k2  [0805]
R9M  2k2  [0805]
R10M  2k2  [0805]
R11M  100  [0805]
R12M  100  [0805]
R13M  4k7  [0805]
R14M  4k7  [0805]
S1M  SPST  [SPST_4x3]
S2M  SPST  [SPST_4x3]
X1M  Button ext  [Header, 2.54mm pitch, 2pin]
X2M  ST Link Debug  [Header, 2.54mm pitch, 2x10pin IDC socket male straight]
X3M  Serial Port  [Header, 2.54mm pitch, 3pin]
X4M  Reset 2pin  [Header, 2.54mm pitch, 2pin]
X5M  LED1 ext  [Header, 2.54mm pitch, 2pin]
X6M  LED2 ext  [Header, 2.54mm pitch, 2pin]
X7M  LED3 ext  [Header, 2.54mm pitch, 2pin]
X8M  LED2 Debug  [Header, 2.54mm pitch, 4pin]
X9M  Radio Debug  [Header, 2.54mm pitch, 7pin]
X10M  Battery Debug  [Header, 2.54mm pitch, 7pin]
X11M  LED1 Debug  [Header, 2.54mm pitch, 4pin]
X12M  Ext Temp Sensor  [Header, 2.54mm pitch, 5pin]

### Ports
BatControl (harness BatControl), LED_Driver1 (harness LED_Driver), LED_Driver2 (harness LED_Driver), LoraRadio (harness Radio), USART2_RX (in), USART2_TX (out)

### Harnesses
BatControl: !SMBALERT, EQ, HEATER, MPPT, SCL, SDA
LED_Driver: !PWM, !SHDN, I_LED
Radio: SCK, MISO, MOSI, CS, RESET, INT

### Nets
GND: C1M.1 C2M.1 C3M.1 C4M.1 C5M.1 C6M.1 C7M.1 C8M.1 C9M.1 C10M.1 C11M.1 C12M.1 G1M.2(GND) K1M.2(GND) K1M.4(PAD) K2M.12(VSSA) K2M.18(VSS) K2M.31(VSS) K2M.47(VSS) K2M.63(VSS) R6M.2 S1M.1(Mitte) S2M.1(Mitte) X1M.1 X2M.3 X2M.4 X2M.5 X2M.6 X2M.8 X2M.10 X2M.12 X2M.14 X2M.16 X2M.18 X2M.20 X3M.1 X4M.1 X8M.1 X9M.1 X10M.1 X11M.1 X12M.1
VDD: C1M.2 C8M.2 C9M.2 C10M.2 C11M.2 C12M.2 G1M.1(E/D) G1M.4(VDD) K1M.3(Vout) K2M.1(VLCD) K2M.19(VDD) K2M.32(VDD) K2M.48(VDD) K2M.64(VDD) P1M.2(Annode) P2M.2(Annode) P3M.2(Annode) R1M.2 R2M.2 R3M.1 R5M.2 R8M.2 R9M.2 R10M.2 R13M.2 X2M.1 X2M.2 X5M.2 X6M.2 X7M.2 X12M.5
VDDA: C4M.2 C5M.2 K2M.13(VDDA) R3M.2
VSYS: K1M.1(Vin)
BOOT0: K2M.60(BOOT0) R5M.1 R6M.1
EQ: K2M.61(PB8) X10M.6 ; port BatControl.EQ
Heater: K2M.22(PA6) X10M.5 ; port BatControl.HEATER
I2C1_SCL: K2M.58(PB6) R9M.1 X10M.3 ; port BatControl.SCL
I2C1_SDA: K2M.59(PB7) R10M.1 X10M.2 ; port BatControl.SDA
I2C1_SMBA: K2M.57(PB5) R8M.1 X10M.7 ; port BatControl.!SMBALERT  [project net !SMBALERT]
ILED1: K2M.20(PA4) X11M.2 ; port LED_Driver1.I_LED  [project net I_LED]
ILED2: K2M.21(PA5) X8M.2 ; port LED_Driver2.I_LED  [project net I_LED]
LED1_PWM: K2M.29(PB10) X11M.4 ; port LED_Driver1.!PWM  [project net !PWM]
LED1_SHDN: K2M.27(PB1) X11M.3 ; port LED_Driver1.!SHDN  [project net !SHDN]
LED2_PWM: K2M.30(PB11) X8M.4 ; port LED_Driver2.!PWM  [project net !PWM]
LED2_SHDN: K2M.28(PB2) X8M.3 ; port LED_Driver2.!SHDN  [project net !SHDN]
MPPT: K2M.62(PB9) X10M.4 ; port BatControl.MPPT
NRST: C3M.2 K2M.7(NRST) R2M.1 S2M.2(Schließer) X2M.15 X4M.2
O32_I: B1M.2 C7M.2 K2M.3(PC14)
O32_O: B1M.1 C6M.2 K2M.4(PC15)
PH0: G1M.3(OUT) K2M.5(PH0)
RADIO_CS: K2M.33(PB12) X9M.4 ; port LoraRadio.CS
RADIO_INT: K2M.38(PC7) X9M.2 ; port LoraRadio.INT
RADIO_RESET: K2M.37(PC6) X9M.3 ; port LoraRadio.RESET
SPI2_MISO: K2M.35(PB14) X9M.6 ; port LoraRadio.MISO
SPI2_MOSI: K2M.36(PB15) X9M.5 ; port LoraRadio.MOSI
SPI2_SCK: K2M.34(PB13) X9M.7 ; port LoraRadio.SCK
SWCLK: K2M.49(PA14) X2M.9
SWDIO: K2M.46(PA13) X2M.7
SWO: K2M.55(PB3) X2M.13
TSENS_AN: K2M.44(PA11) X12M.2
TSENS_DAT: K2M.42(PA9) R13M.1 R14M.1 X12M.3
TSENS_VDD: K2M.41(PA8) R14M.2 X12M.4
USART2_RX: K2M.17(PA3) X3M.3 ; port USART2_RX
USART2_TX: K2M.16(PA2) X3M.2 ; port USART2_TX
User_Button: C2M.2 K2M.2(PC13) R1M.1 S1M.2(Schließer) X1M.2
User_LED1: K2M.53(PC12) R7M.1
User_LED2: K2M.52(PC11) R11M.1
User_LED3: K2M.51(PC10) R12M.1
NetP1M_1: P1M.1(Kathode) R7M.2 X5M.1
NetP2M_1: P2M.1(Kathode) R11M.2 X6M.1
NetP3M_1: P3M.1(Kathode) R12M.2 X7M.1

Not connected (* = marked no-connect by the designer): K2M 6(PH1) 8(PC0) 9(PC1) 10(PC2) 11(PC3) 14(PA0) 15(PA1) 23(PA7) 24(PC4) 25(PC5) 26(PB0) 39(PC8) 40(PC9) 43(PA10) 45(PA12) 50(PA15) 54(PD2) 56(PB4); X2M 11 17 19

### Notes on the sheet
- LDO
- User Button
- Reset
- (near C1M) LDO-Supplyg MCU Radio:
  -----------------------------
  Uin: 2,5 - 25 V
  Uout: 3,3V
  Imax: 200mA
- (near B1M) RTE Clock
- SysClock
- Program/Debug
- (near X2M) PA13
- (near X2M) PA14
- (near X2M) PB3
- (near X3M) Serial Port
- Bus Debug Stecker
- (near R5M) Boot Selector
- (near R5M) not fitted
- External Temperature Sensor
- (near R13M) Connect either R13M or R14M.
  default R14M fitted
- Title
- Size:
- Date:
- A4
- Number:
- Time:
- Revision:
- Sheet
- of
- File:

### Library data of the parts
B1M = Quarz: Lieferant: Farnell; Bestell-Nr.: 2467861; Preis: 1,58; Hersteller: ABRACON; Bezeichnung: ABS06-32.768KHZ-9-1-T; Bauform: 0805; Option: *
C1M C4M = Kondensator: as C1R on sheet radio; Bauform: 0805
C2M C3M C5M C9M C10M C11M C12M = Kondensator: as C1B on sheet battery_charger; Bauform: 0805
C6M C7M = Kondensator: Bezeichnung: MC0805N9R0D500CT; Hersteller: MULTICOMP; Lieferant: Farnell; Bestell-Nr.: 1759189; Bauform: 0805
C8M = Kondensator: as C19B on sheet battery_charger; Bauform: 0805
G1M = Quarz Oszillator: Bezeichnung: ASEMB-8.000MHZ-LY-T; Bauform: SMD; Hersteller: ABRACON; Lieferant: Farnell; Bestell-Nr.: 2673051
K1M = LDO_2: Bezeichnung: MIC5201-3.3YS-TR; Bestell-Nr.: 910-1795; Lieferant: RS Components; Hersteller: Microchip; Preis: *; Bauform: *
K2M = STM32L15xRE_64: Lieferant: Farnell; Bestell-Nr.: 2469628; Hersteller: STMicroelectronics; Bezeichnung: STM32L152RET6; Bauform: SMD; Option: *
P1M = LED: Bezeichnung: KP-3216CGCK; Lieferant: Farnell; Hersteller: KINGBRIGHT; Bestell-Nr.: 2290333; Preis: *; Bauform: *
P2M = LED: Bezeichnung: KP-3216SYC; Lieferant: Farnell; Hersteller: KINGBRIGHT; Bestell-Nr.: 8529990; Preis: *; Bauform: *
P3M = LED: Bezeichnung: KP-3216EC; Lieferant: Farnell; Hersteller: KINGBRIGHT; Bestell-Nr.: 8530025; Preis: *; Bauform: *
R1M R2M = Widerstand: as R12B on sheet battery_charger; Bauform: 0805
R3M = Induktivität: EMI Filter; Bezeichnung: BMB2A0600BN3; Lieferant: Farnell; Bestell-Nr.: 2329425; Hersteller: TE Connectivity; Bauform: 0805
R5M R6M = Widerstand: as R3B on sheet battery_charger; Bauform: 0805
R7M R11M R12M = Widerstand: Bezeichnung: MCWR08X1000FTL; Lieferant: Farnell; Bestell-Nr.: 2447552; Hersteller: MULTICOMP; Bauform: 0805
R8M R9M R10M = Widerstand: Bezeichnung: MCWF08P2201FTL; Lieferant: Farnell; Bestell-Nr.: 2694118; Hersteller: MULTICOMP; Bauform: 0805
R13M R14M = Widerstand: Bezeichnung: MCWF08P4701FTL; Lieferant: Farnell; Bestell-Nr.: 2694141; Hersteller: MULTICOMP; Bauform: 0805
S1M S2M = SPST: single pole, single throw; Bestell-Nr.: 135-9374; Bezeichnung: PTS820 J25K SMTR LFS; Hersteller: C&K Components; Lieferant: Farnell; Bauform: *
X1M X4M X5M X6M X7M = Header 2pin: Hersteller: RS Pro; Lieferant: RS; Bezeichnung: Stiftleiste; Bestell-Nr.: 251-8086; Bauform: *; Preis: *
X2M = Header 2x10pin: Bezeichnung: 1761681-7; Bestell-Nr.: 680-1335; Lieferant: RS Components; Hersteller: TE Connectivity; Bauform: IDC 2x10 2.54mm pitch
X3M = Header 3pin: Hersteller: Molex; Bauform: Through Hole; Bezeichnung: 22-03-2031
X8M X11M = Header 4pin: Hersteller: *; Bestell-Nr.: *; Lieferant: *; Bezeichnung: *; Preis: *; Bauform: *
X9M X10M = Header 7pin: Bezeichnung: *; Preis: *; Bestell-Nr.: *; Hersteller: *; Lieferant: *; Bauform: *
X12M = Header 5pin: Bezeichnung: *; Preis: *; Bestell-Nr.: *; Hersteller: *; Lieferant: *; Bauform: *

## Nets that join several sheets
GND: battery_charger (35 pins), USB (6 pins), L1 (15 pins), L2 (15 pins), radio (7 pins), MCU (42 pins)
VBUS: battery_charger (R6B.2), USB (5 pins)
VDD: battery_charger (A1B.3 C11B.1), radio (A1R.13 C1R.2 C2R.2), MCU (31 pins)
VSYS: battery_charger (11 pins), L1 (6 pins), L2 (6 pins), MCU (K1M.1)
!PWM: L1 (R16L1.1), MCU (K2M.29 X11M.4)
!PWM: L2 (R16L2.1), MCU (K2M.30 X8M.4)
!SHDN: L1 (A1L1.3), MCU (K2M.27 X11M.3)
!SHDN: L2 (A1L2.3), MCU (K2M.28 X8M.3)
!SMBALERT: battery_charger (A1B.6), MCU (K2M.57 R8M.1 X10M.7)
EQ: battery_charger (R23B.1), MCU (K2M.61 X10M.6)
Heater: battery_charger (R17B.1), MCU (K2M.22 X10M.5)
I2C1_SCL: battery_charger (A1B.4), MCU (K2M.58 R9M.1 X10M.3)
I2C1_SDA: battery_charger (A1B.5), MCU (K2M.59 R10M.1 X10M.2)
I_LED: L1 (R9L1.2), MCU (K2M.20 X11M.2)
I_LED: L2 (R9L2.2), MCU (K2M.21 X8M.2)
MPPT: battery_charger (R24B.1), MCU (K2M.62 X10M.4)
RADIO_CS: radio (A1R.5), MCU (K2M.33 X9M.4)
RADIO_INT: radio (A1R.14), MCU (K2M.38 X9M.2)
RADIO_RESET: radio (A1R.6), MCU (K2M.37 X9M.3)
SPI2_MISO: radio (A1R.2), MCU (K2M.35 X9M.6)
SPI2_MOSI: radio (A1R.3), MCU (K2M.36 X9M.5)
SPI2_SCK: radio (A1R.4), MCU (K2M.34 X9M.7)
USART2_RX: USB (A1U.26), MCU (K2M.17 X3M.3)
USART2_TX: USB (A1U.25), MCU (K2M.16 X3M.2)